# Altium project stm32f103c8t6最小系统.PrjPcb
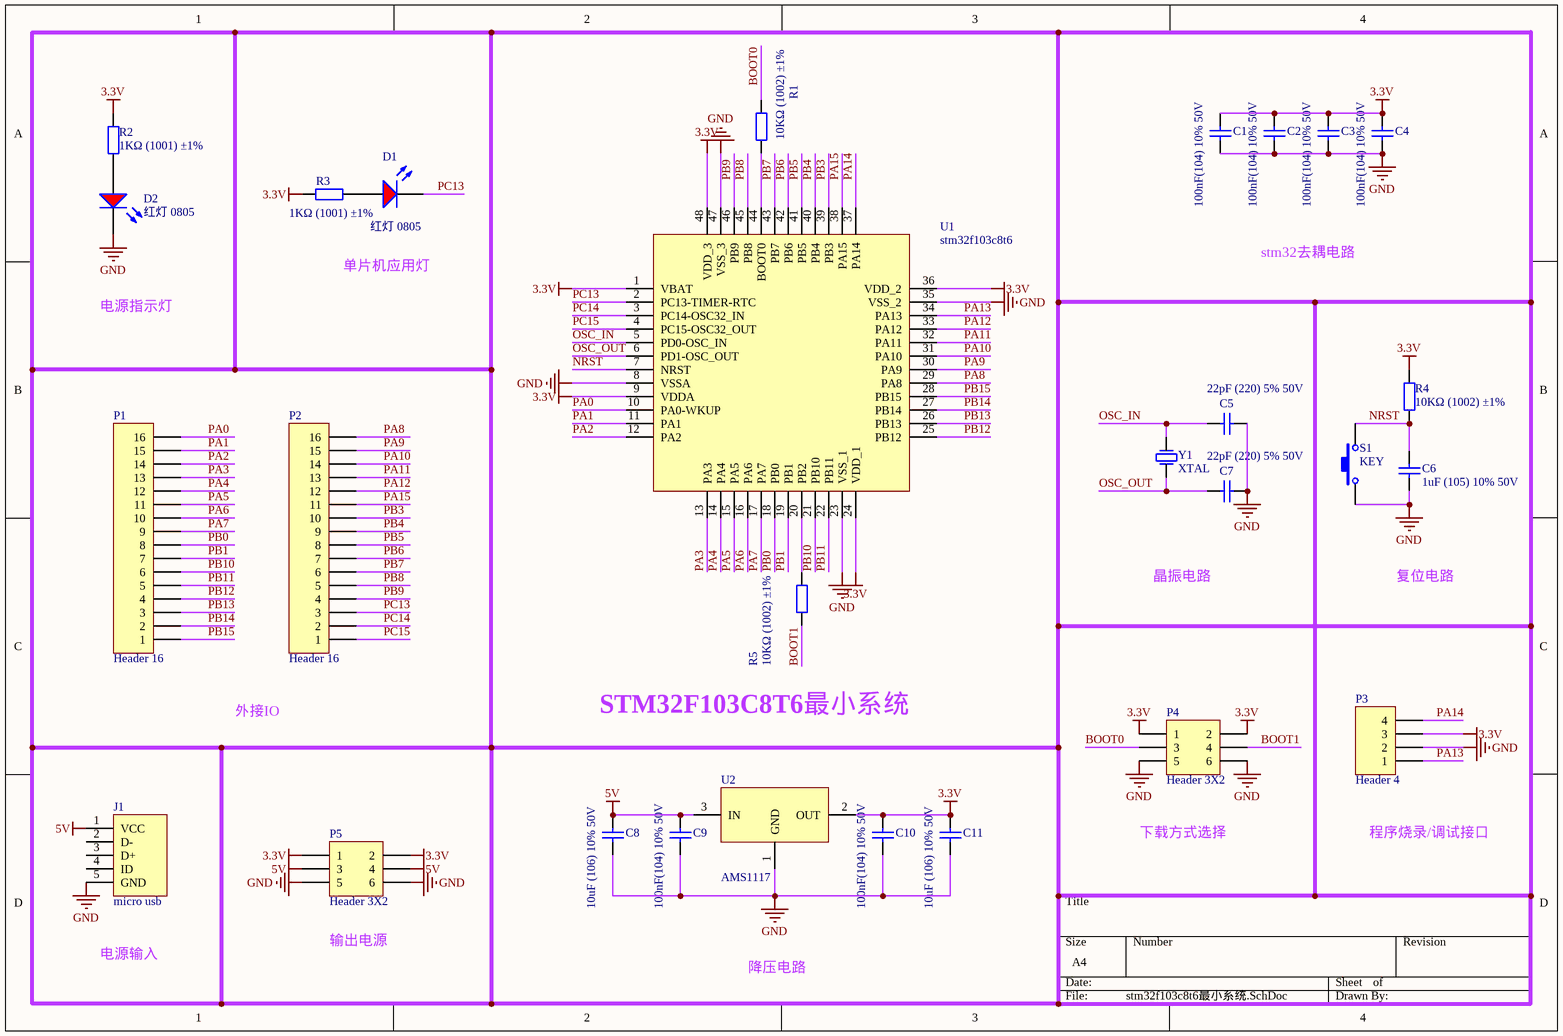
[diagram p0: stm32f103c8t6最小系统.SchDoc]
1 sheet, 28 parts. Net scope: global (net labels, ports and power ports of the same name join across sheets).
Board file: stm32f103c8t6最小系统.PcbDoc

## Sheet stm32f103c8t6最小系统.SchDoc
size A4

### Parts
C1  100nF(104) 10% 50V  [0805_C]
C2  100nF(104) 10% 50V  [0805_C]
C3  100nF(104) 10% 50V  [0805_C]
C4  100nF(104) 10% 50V  [0805_C]
C5  22pF (220) 5% 50V  [0805_C]
C6  1uF (105) 10% 50V  [0805_C]
C7  22pF (220) 5% 50V  [0805_C]
C8  10uF (106) 10% 50V  [1206_C]
C9  100nF(104) 10% 50V  [0805_C]
C10  100nF(104) 10% 50V  [0805_C]
C11  10uF (106) 10% 50V  [1206_C]
D1  红灯 0805  [0805_LED_S1]
D2  红灯 0805  [0805_LED_S1]
J1  micro usb  [micro usb]
P1  Header 16  [HDR1X16]
P2  Header 16  [HDR1X16]
P3  Header 4  [HDR1X4]
P4  Header 3X2  [HDR2X3]
P5  Header 3X2  [HDR2X3]
R1  10KΩ (1002) ±1%  [0805_R]
R2  1KΩ (1001) ±1%  [0805_R]
R3  1KΩ (1001) ±1%  [0805_R]
R4  10KΩ (1002) ±1%  [0805_R]
R5  10KΩ (1002) ±1%  [0805_R]
S1  KEY  [KEY]
U1  stm32f103c8t6  [stm32f103c8t6]
U2  AMS1117  [AMS1117]
Y1  XTAL  [XTAL]

### Nets
3.3V: C1.2 C2.2 C3.2 C4.2 C10.2 C11.2 P3.3 P4.1 P4.2 P5.1 P5.2 R2.2 R3.2 R4.2 U1.1(VBAT) U1.9(VDDA) U1.24(VDD_1) U1.36(VDD_2) U1.48(VDD_3) U2.2(OUT)
5V: C8.2 C9.2 J1.1(VCC) P5.3 P5.4 U2.3(IN)
GND: C1.1 C2.1 C3.1 C4.1 C5.2 C6.1 C7.2 C8.1 C9.1 C10.1 C11.1 D2.K J1.5(GND) P3.2 P4.5 P4.6 P5.5 P5.6 S1.1 U1.8(VSSA) U1.23(VSS_1) U1.35(VSS_2) U1.47(VSS_3) U2.1(GND)
BOOT0: P4.3 R1.2
BOOT1: P4.4 R5.1
NRST: C6.2 R4.1 S1.2 U1.7(NRST)
OSC_IN: C5.1 U1.5(PD0-OSC_IN) Y1.2
OSC_OUT: C7.1 U1.6(PD1-OSC_OUT) Y1.1
PA0: P1.16 U1.10(PA0-WKUP)
PA1: P1.15 U1.11(PA1)
PA2: P1.14 U1.12(PA2)
PA3: P1.13 U1.13(PA3)
PA4: P1.12 U1.14(PA4)
PA5: P1.11 U1.15(PA5)
PA6: P1.10 U1.16(PA6)
PA7: P1.9 U1.17(PA7)
PA8: P2.16 U1.29(PA8)
PA9: P2.15 U1.30(PA9)
PA10: P2.14 U1.31(PA10)
PA11: P2.13 U1.32(PA11)
PA12: P2.12 U1.33(PA12)
PA13: P3.1 U1.34(PA13)
PA14: P3.4 U1.37(PA14)
PA15: P2.11 U1.38(PA15)
PB0: P1.8 U1.18(PB0)
PB1: P1.7 U1.19(PB1)
PB3: P2.10 U1.39(PB3)
PB4: P2.9 U1.40(PB4)
PB5: P2.8 U1.41(PB5)
PB6: P2.7 U1.42(PB6)
PB7: P2.6 U1.43(PB7)
PB8: P2.5 U1.45(PB8)
PB9: P2.4 U1.46(PB9)
PB10: P1.6 U1.21(PB10)
PB11: P1.5 U1.22(PB11)
PB12: P1.4 U1.25(PB12)
PB13: P1.3 U1.26(PB13)
PB14: P1.2 U1.27(PB14)
PB15: P1.1 U1.28(PB15)
PC13: D1.K P2.3 U1.2(PC13-TIMER-RTC)
PC14: P2.2 U1.3(PC14-OSC32_IN)
PC15: P2.1 U1.4(PC15-OSC32_OUT)
NetD1_A: D1.A R3.1
NetD2_A: D2.A R2.1
NetR1_1: R1.1 U1.44(BOOT0)
NetR5_2: R5.2 U1.20(PB2)

Not connected (* = marked no-connect by the designer): J1 2(D-) 3(D+) 4(ID)

### Notes on the sheet
- 电源指示灯
- 单片机应用灯
- stm32去耦电路
- 晶振电路
- 复位电路
- 外接IO
- STM32F103C8T6最小系统
- 下载方式选择
- 程序烧录/调试接口
- 电源输入
- (near P5) 输出电源
- 降压电路

### Library data of the parts
C1-C4 C9 C10 = 0805 100nF(104) 10% 50V: 贴片电容; ComponentLink1Description: 供应商链接; ComponentLink1URL: http://www.szlcsc.com/product/details_50686.html; Package: 0805; Supplier: LC; SuppliersPartNumber: C49678
C5 C7 = 0805 22pF (220) 5% 50V: 贴片电容; ComponentLink1Description: 供应商链接; ComponentLink1URL: http://www.szlcsc.com/product/details_2156.html; Package: 0805; Supplier: LC; SuppliersPartNumber: C1804
C6 = 0805 1uF (105) 10% 50V: 贴片电容; ComponentLink1Description: 供应商链接; ComponentLink1URL: http://www.szlcsc.com/product/details_29074.html; Package: 0805; Supplier: LC; SuppliersPartNumber: C28323
C8 C11 = 1206 10uF (106) 10% 50V: 贴片电容; ComponentLink1Description: 供应商链接; ComponentLink1URL: http://www.szlcsc.com/product/details_14236.html; Package: 1206; Supplier: LC; SuppliersPartNumber: C13585
D1 D2 = 0805 红灯: 发光二极管; ComponentLink1Description: 供应商链接; ComponentLink1URL: http://www.szlcsc.com/product/details_2668.html; Package: 0805; Supplier: LC; SuppliersPartNumber: C2295
P1 P2 = Header 16: Header, 16-Pin; LatestRevisionDate: 17-Jul-2002; LatestRevisionNote: Re-released for DXP Platform.; Publisher: Altium Limited
P3 = Header 4: Header, 4-Pin; LatestRevisionDate: 17-Jul-2002; LatestRevisionNote: Re-released for DXP Platform.; Publisher: Altium Limited
P4 P5 = Header 3X2: Header, 3-Pin, Dual row; LatestRevisionDate: 17-Jul-2002; LatestRevisionNote: Re-released for DXP Platform.; Publisher: Altium Limited
R1 R4 R5 = 0805 10KΩ (1002) 1%: 贴片电阻; ComponentLink1Description: 供应商链接; ComponentLink1URL: http://www.szlcsc.com/product/details_18102.html; Package: 0805; Supplier: LC; SuppliersPartNumber: C17414
R2 R3 = 0805 1KΩ (1001) 1%: 贴片电阻; ComponentLink1Description: 供应商链接; ComponentLink1URL: http://www.szlcsc.com/product/details_18201.html; Package: 0805; Supplier: LC; SuppliersPartNumber: C17513